# Altium project DHT11_Module.PrjPcb
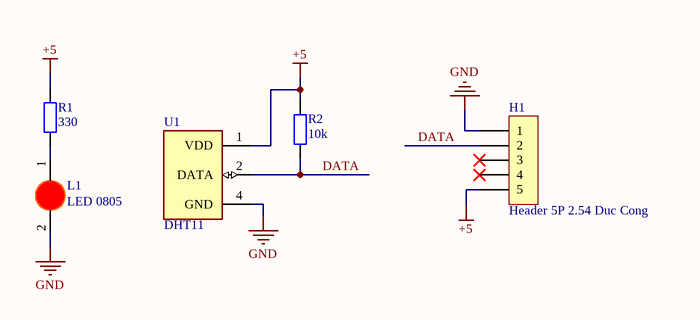
[diagram p0: DHT11_SCH.SchDoc]
1 sheet, 5 parts. Net scope: global (net labels, ports and power ports of the same name join across sheets).
Board file: DHT11_PCB.PcbDoc

## Sheet DHT11_SCH.SchDoc
size A4; SheetNumber: 1; SheetTotal: 1

### Parts
H1  Header 5P 2.54 Duc Cong  [Header 5P DC 2.54]
L1  LED 0805  [LED-0805-Red]
R1  330  [tro smd 0603]
R2  10k  [tro smd 0603]
U1  DHT11  [DHT11]

### Nets
+5: H1.5 R1.2 R2.2 U1.1(VDD)
GND: H1.1 L1.2(K) U1.4(GND)
DATA: H1.2 R2.1 U1.2(DATA)
NetL1_1: L1.1(A) R1.1

Not connected (* = marked no-connect by the designer): H1 3* 4*

### Library data of the parts
H1 = Header 5P 2.54 Duc Cong: Cắm; Ten_Linh_Kien: Header 5P XH2.54-5P Đực Cong; Don_Vi: Con; Ma_Hang: MH001308; Chung_Loai: Cắm
L1 = LED 0805 Do: Dán; Don_Vi: Con; Ma_Hang: MH000897; Ten_Linh_Kien: LED 0805 Màu Đỏ (Red); Ghi_Chu: *; Kieu_Chan: *; Chung_Loai: Dán
R1 R2 = Tro 0603 1% 10k: Dán; Don_Vi: Con; So_Chan: 2; Ten_Linh_Kien: Trở 0603 1% 10k; Ma_Hang: MH006333; Chung_Loai: Dán; Kieu_Chan: *
U1 = DHT11: DHT11 basic temperature-humidity sensor + extras; MF: Adafruit Industries; MP: ADA386; Value: *; Package: None; SnapEDA_Link: https://www.snapeda.com/parts/ADA386/Adafruit%20Industries/view-part/106068/?ref=snap; Price: None; Availability: Unavailable